# EasyEDA Pro project NFC_Module.epro

# Schematic NFC Mode
Board Name: PCB3; Create Date: 2026-04-15; Page Name: P1; Project Name: ESP32_Buspirate_complete; Schematic Name: NFC Mode; Update Date: 2026-04-15; Company: EasyEDA.com; Page Size: A4; Version: V1.0
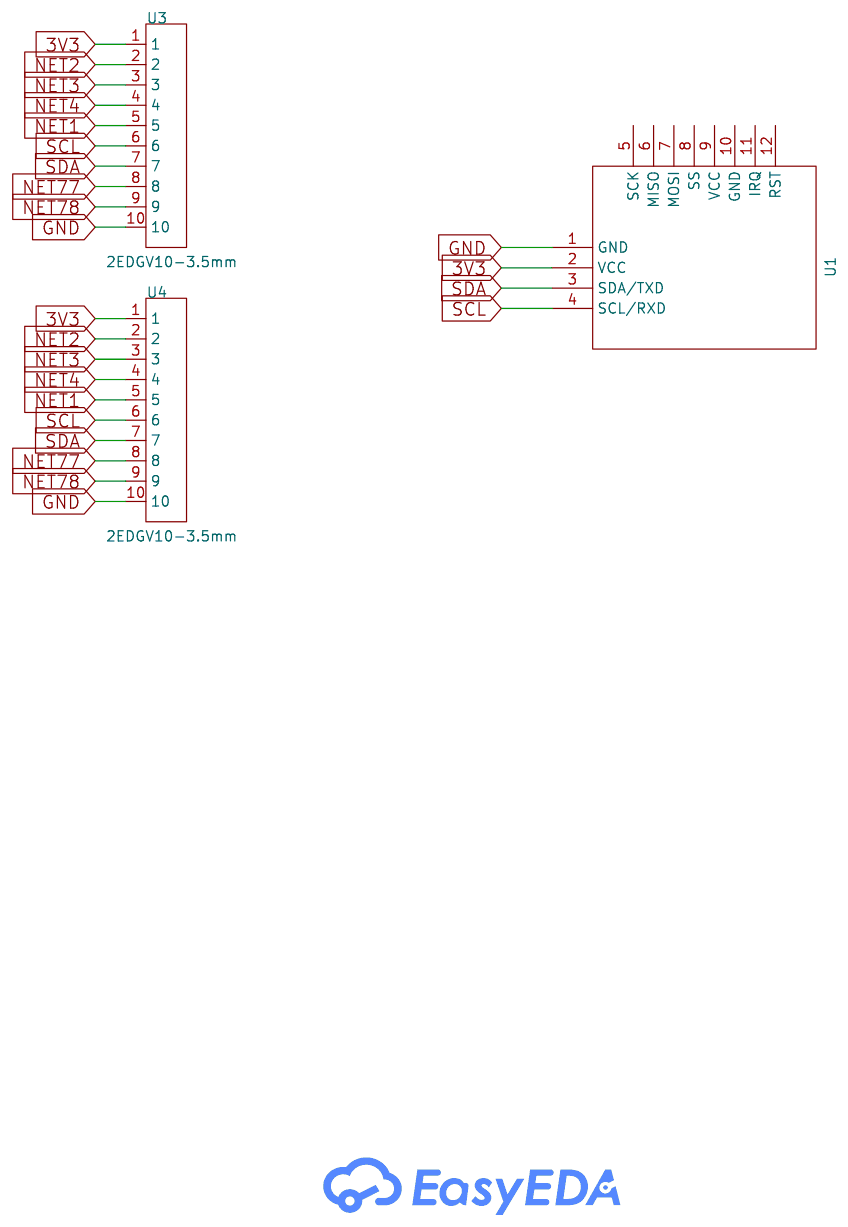
[diagram p0: schematic sheet]

## Parts
U1  -  [PN532]
U3  2EDGV10-3.5mm  [CONN-TH_10P-P2.50_B10B-EH-A-LF-SN]
U4  2EDGV10-3.5mm  [CONN-TH_10P-P2.50_B10B-EH-A-LF-SN]

## Library data of the parts
U1 = PN532
U3 U4 = CONN-TH_10P-P3.50: Supplier Part: C9900014909; Supplier Footprint: 2EDG_10p_3.5mm; JLCPCB Part Class: Extended Part; Supplier: LCSC

## Nets
3V3: U1.2(VCC) U3.1 U4.1
GND: U1.1(GND) U3.10 U4.10
NET1: U3.5 U4.5
NET2: U3.2 U4.2
NET3: U3.3 U4.3
NET4: U3.4 U4.4
NET77: U3.8 U4.8
NET78: U3.9 U4.9
SCL: U1.4(SCL/RXD) U3.6 U4.6
SDA: U1.3(SDA/TXD) U3.7 U4.7

Not connected (* = marked no-connect by the designer): U1 5(SCK) 6(MISO) 7(MOSI) 8(SS) 9(VCC) 10(GND) 11(IRQ) 12(RST)

# Board PCB3
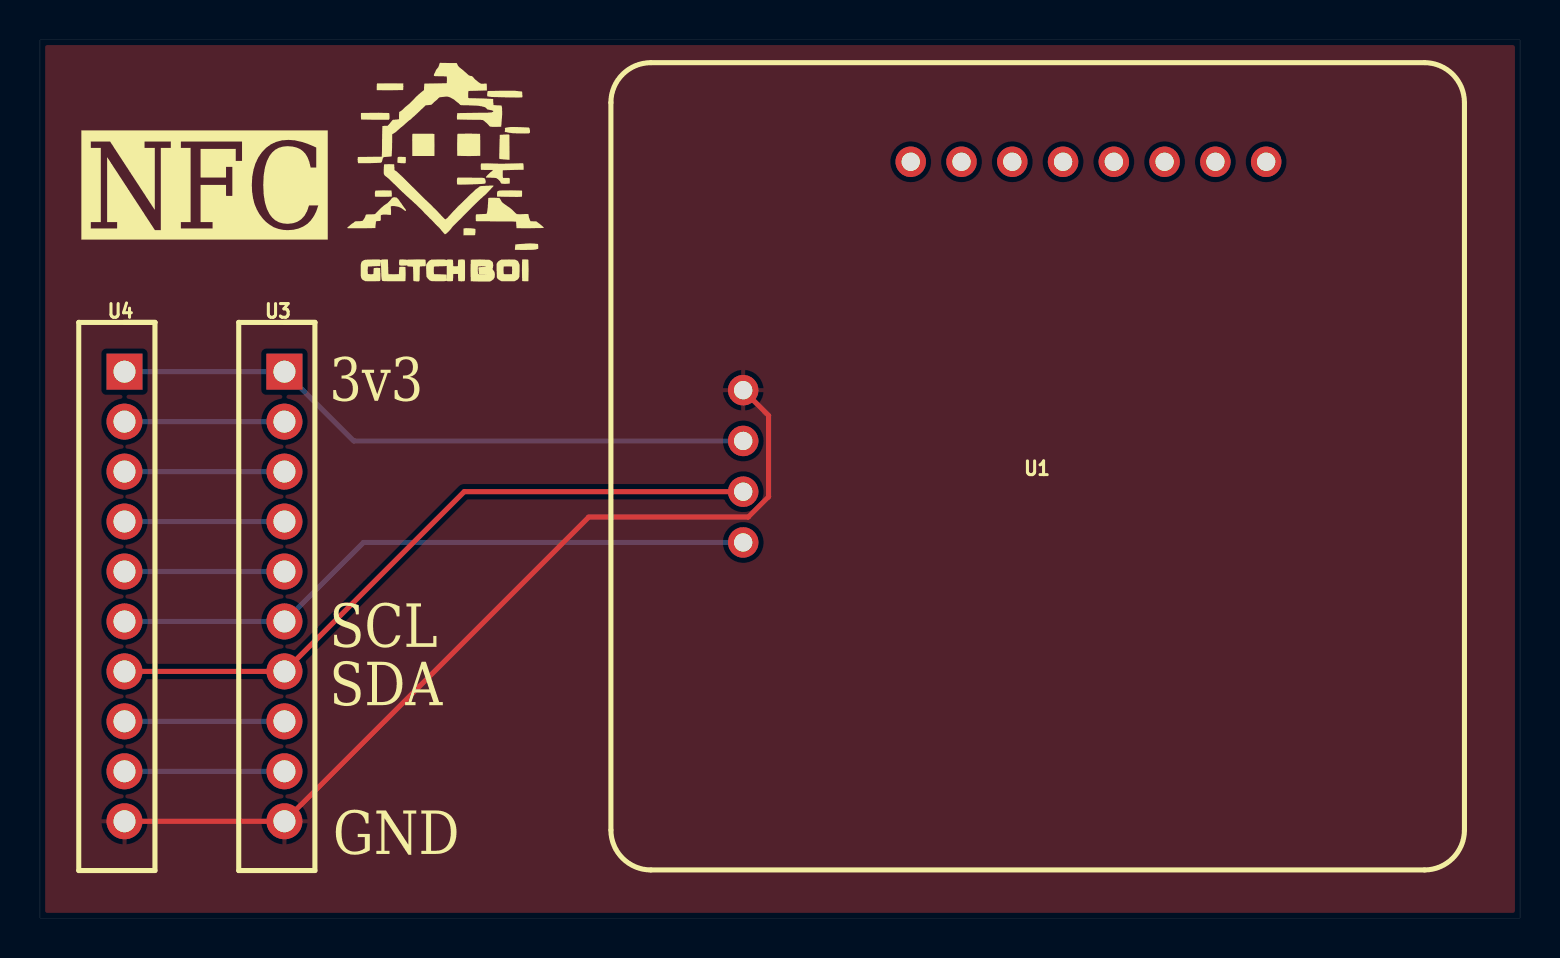
[diagram p1: board, top side]
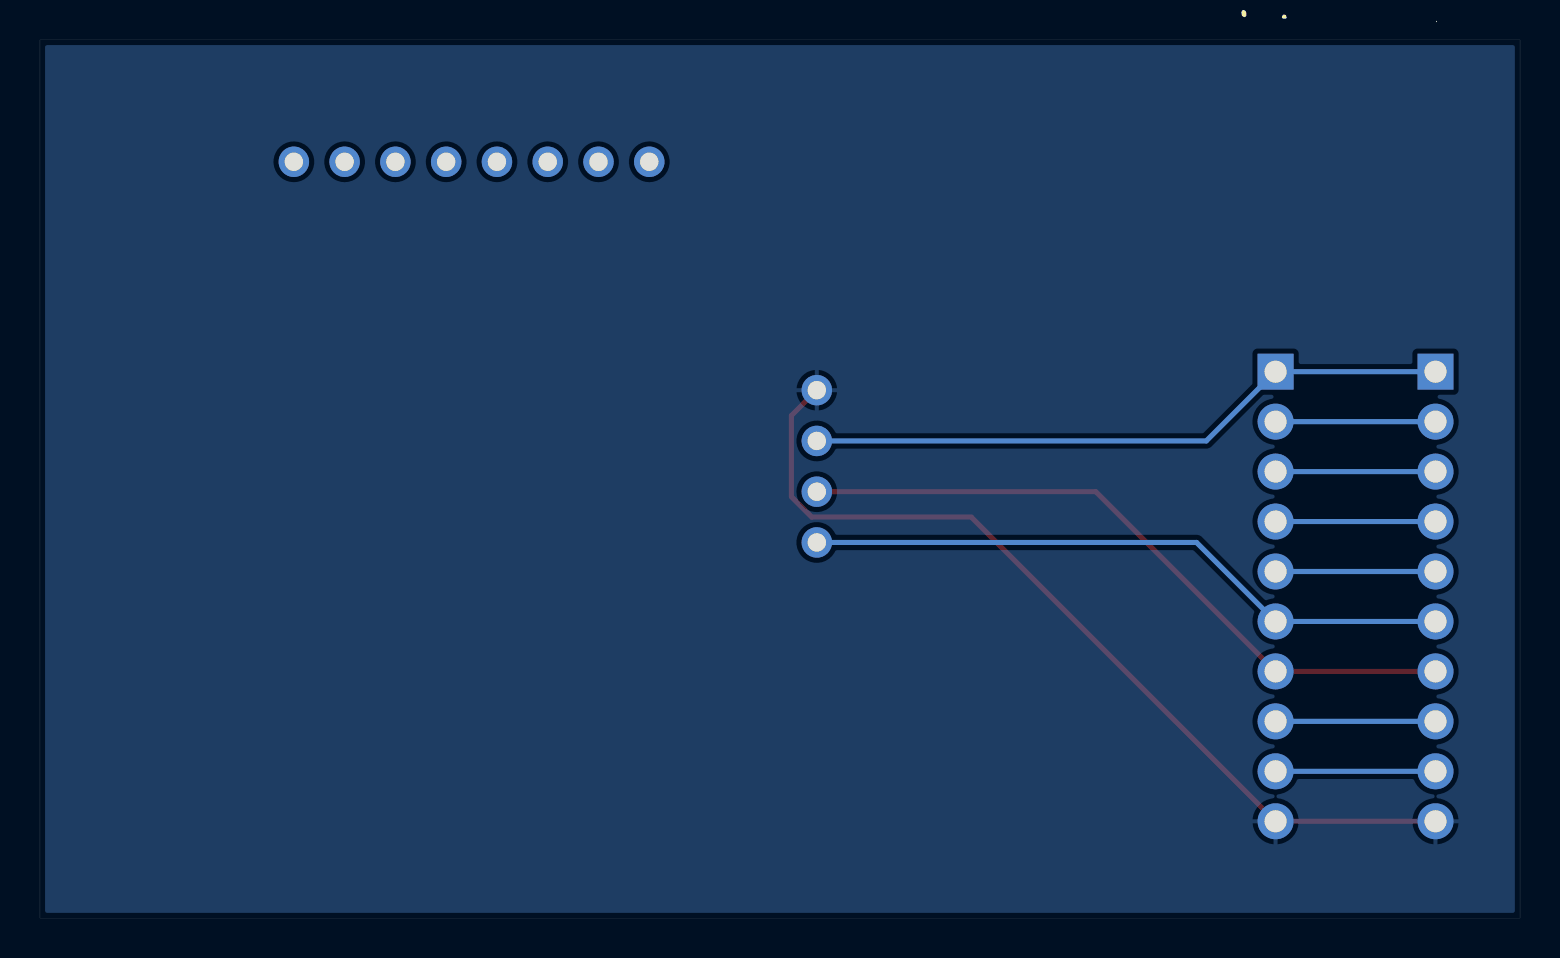
[diagram p2: board, bottom side, seen from below]

Outline 74.04 x 43.94 mm; copper layers: Top Layer, Bottom Layer. Coordinates in mm from the lower left corner of the outline.
Outline path: rectangle 0,43.94 74.04,0
Stack: Top Layer 0.035mm / Dielectric1 1.51mm FR4 er 4.5 / Bottom Layer 0.035mm

## Design rules (mm)
template: JLCPCB Capability(Two Layers Board)
spacing copperThickness1oz (default): track to track 0.102, other pairs 0.152 to 0.3
spacing copperThickness2oz: track to track 0.203, other pairs 0.152 to 0.3
track width copperThickness1oz (default): min 0.127, default 0.254, max 2.54
track width copperThickness2oz: min 0.203, default 0.254, max 2.54
differential pair differentialPair (default): width min 0.127, default 0.254, max 2.54; gap min 0.152, default 0.152
via viaSize (default): diameter min 0.5, default 0.61, max 10; hole min 0.3, default 0.305, max 6.3

## Placement (name value [footprint] x y rotation side)
U1  -  [PN532]  49.91 22.61 0 top
U3  2EDGV10-3.5mm  [CONN-TH_10P-P2.50_B10B-EH-A-LF-SN]  12.23 16.09 270 top
U4  2EDGV10-3.5mm  [CONN-TH_10P-P2.50_B10B-EH-A-LF-SN]  4.23 16.09 270 top

## Footprints (pads in the part's own frame, mm; a bottom-side part is the same pattern mirrored in y, then rotated)
CONN-TH_10P-P2.50_B10B-EH-A-LF-SN
  rect 1.8x1.8 hole 1.1: 1(-11.25,0)
  round 1.8 hole 1.1: 2(-8.75,0) 3(-6.25,0) 4(-3.75,0) 5(-1.25,0) 6(1.25,0) 7(3.75,0) 8(6.25,0) 9(8.75,0) 10(11.25,0)
PN532
  round 1.524 hole 0.914: 1(-14.732,3.81) 2(-14.732,1.27) 3(-14.732,-1.27) 4(-14.732,-3.81) 5(-6.35,15.24) 6(-3.81,15.24) 7(-1.27,15.24) 8(1.27,15.24) 9(3.81,15.24) 10(6.35,15.24) 11(8.89,15.24) 12(11.43,15.24)

## Nets
As in the schematic.

Pads without a net: U1 5 6 7 8 9 10 11 12

## Routing (per net, layer and track width the routed paths; a pad name or vN(x,y) marks a point on that pad's centre or on a via; arc(x,y) is an arc through that point)
3V3: length 32.4
  Bottom Layer w0.254: U1.2 15.69,23.88 U3.1 U4.1
GND: length 44.8
  Top Layer w0.254: U1.1 36.45,25.15 36.45,21.08 35.43,20.07 27.45,20.07 U3.10 U4.10
NET1: length 8
  Bottom Layer w0.254: U3.5 U4.5
NET2: length 8
  Bottom Layer w0.254: U3.2 U4.2
NET3: length 8
  Bottom Layer w0.254: U3.3 U4.3
NET4: length 8
  Bottom Layer w0.254: U3.4 U4.4
NET77: length 8
  Bottom Layer w0.254: U3.8 U4.8
NET78: length 8
  Bottom Layer w0.254: U3.9 U4.9
SCL: length 32.6
  Bottom Layer w0.254: U1.4 16.18,18.8 U3.6 U4.6
SDA: length 34.7
  Top Layer w0.254: U1.3 21.22,21.34 U3.7 U4.7

## Copper pours and planes (outline as drawn; the poured copper is in the pictures)
GND on Top Layer: 0,44.07 74.17,44.07 74.17,0 0,0
GND on Bottom Layer: 0,44.2 74.17,44.2 74.17,-0.13 0,-0.13

## Text on the board
Top Silkscreen Layer: 3v3 | SCL | SDA | GND | NFC
